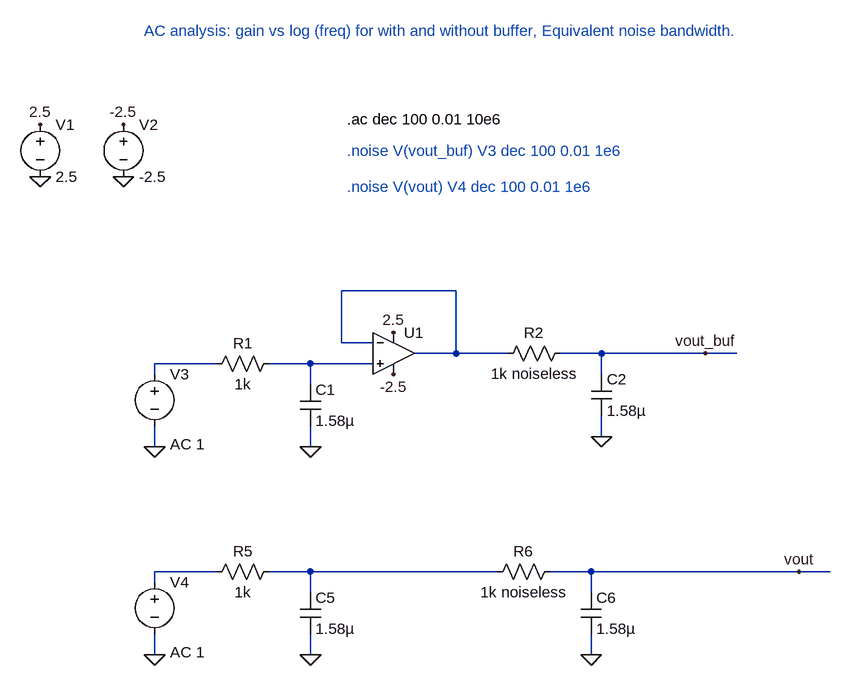
[diagram p0: schematic RC_cascade.asc]
RC_cascade.asc, the LTspice schematic file:
Version 4
SHEET 1 1892 680
WIRE 368 16 192 16
WIRE 192 96 192 16
WIRE 240 96 192 96
WIRE 368 112 368 16
WIRE 368 112 304 112
WIRE 448 112 368 112
WIRE 592 112 528 112
WIRE 752 112 592 112
WIRE 800 112 752 112
WIRE 0 128 -96 128
WIRE 144 128 80 128
WIRE 240 128 144 128
WIRE -96 144 -96 128
WIRE 592 144 592 112
WIRE 144 160 144 128
WIRE 592 240 592 208
WIRE -96 256 -96 224
WIRE 144 256 144 224
WIRE 0 448 -96 448
WIRE 144 448 80 448
WIRE 432 448 144 448
WIRE 576 448 512 448
WIRE 896 448 576 448
WIRE 944 448 896 448
WIRE -96 464 -96 448
WIRE 144 480 144 448
WIRE 576 480 576 448
WIRE -96 576 -96 544
WIRE 144 576 144 544
WIRE 576 576 576 544
FLAG 144 256 0
FLAG -272 -240 2.5
FLAG -144 -240 -2.5
FLAG -272 -160 0
FLAG -144 -160 0
FLAG 272 80 2.5
FLAG 272 144 -2.5
FLAG 592 240 0
FLAG -96 256 0
FLAG 144 576 0
FLAG 576 576 0
FLAG -96 576 0
FLAG 896 448 vout
FLAG 752 112 vout_buf
SYMBOL res 96 112 R90
WINDOW 0 0 56 VBottom 2
WINDOW 3 32 56 VTop 2
SYMATTR InstName R1
SYMATTR Value 1k
SYMBOL cap 128 160 R0
SYMATTR InstName C1
SYMATTR Value 1.58µ
SYMBOL UniversalOpamp2 272 112 R0
SYMATTR InstName U1
SYMBOL voltage -272 -256 R0
WINDOW 123 0 0 Left 0
WINDOW 39 0 0 Left 0
SYMATTR InstName V1
SYMATTR Value 2.5
SYMBOL voltage -144 -256 R0
WINDOW 123 0 0 Left 0
WINDOW 39 0 0 Left 0
SYMATTR InstName V2
SYMATTR Value -2.5
SYMBOL res 544 96 R90
WINDOW 0 0 56 VBottom 2
WINDOW 3 32 56 VTop 2
SYMATTR InstName R2
SYMATTR Value 1k noiseless
SYMBOL cap 576 144 R0
SYMATTR InstName C2
SYMATTR Value 1.58µ
SYMBOL voltage -96 128 R0
WINDOW 123 24 124 Left 2
WINDOW 39 0 0 Left 0
SYMATTR Value2 AC 1
SYMATTR InstName V3
SYMATTR Value ""
SYMBOL res 96 432 R90
WINDOW 0 0 56 VBottom 2
WINDOW 3 32 56 VTop 2
SYMATTR InstName R5
SYMATTR Value 1k
SYMBOL cap 128 480 R0
SYMATTR InstName C5
SYMATTR Value 1.58µ
SYMBOL res 528 432 R90
WINDOW 0 0 56 VBottom 2
WINDOW 3 32 56 VTop 2
SYMATTR InstName R6
SYMATTR Value 1k noiseless
SYMBOL cap 560 480 R0
SYMATTR InstName C6
SYMATTR Value 1.58µ
SYMBOL voltage -96 448 R0
WINDOW 123 24 124 Left 2
WINDOW 39 0 0 Left 0
SYMATTR Value2 AC 1
SYMATTR InstName V4
SYMATTR Value ""
TEXT 200 -248 Left 2 !.ac dec 100 0.01 10e6
TEXT 200 -200 Left 2 ;.noise V(vout_buf) V3 dec 100 0.01 1e6
TEXT 200 -144 Left 2 ;.noise V(vout) V4 dec 100 0.01 1e6
TEXT -112 -384 Left 2 ;AC analysis: gain vs log (freq) for with and without buffer, Equivalent noise bandwidth.

The netlist it stands for:
* RC_cascade.asc
R1 N003 N002 1k
C1 N003 0 1.58µ
XU1 N003 N001 2.5 -2.5 N001 level.2 Avol=1Meg GBW=10Meg Slew=10Meg ilimit=25m rail=0 Vos=0 phimargin=45 en=0 enk=0 in=0 ink=0 Rin=500Meg  ; pins IN+ IN- V+ V- OUT
V1 2.5 0 2.5
V2 -2.5 0 -2.5
R2 vout_buf N001 1k noiseless
C2 vout_buf 0 1.58µ
V3 N002 0 AC 1
R5 N005 N004 1k
C5 N005 0 1.58µ
R6 vout N005 1k noiseless
C6 vout 0 1.58µ
V4 N004 0 AC 1
.ac dec 100 0.01 10e6
* .noise V(vout_buf) V3 dec 100 0.01 1e6
* .noise V(vout) V4 dec 100 0.01 1e6
* AC analysis: gain vs log (freq) for with and without buffer, Equivalent noise bandwidth.
.lib UniversalOpamps2.sub
.backanno
.end